# Altium schematic sheet Lab10.SCHDOC
size 420 x 297 mm; SheetNumber: 1; SheetTotal: 1; DocumentName: Sheet1.SCHDOC
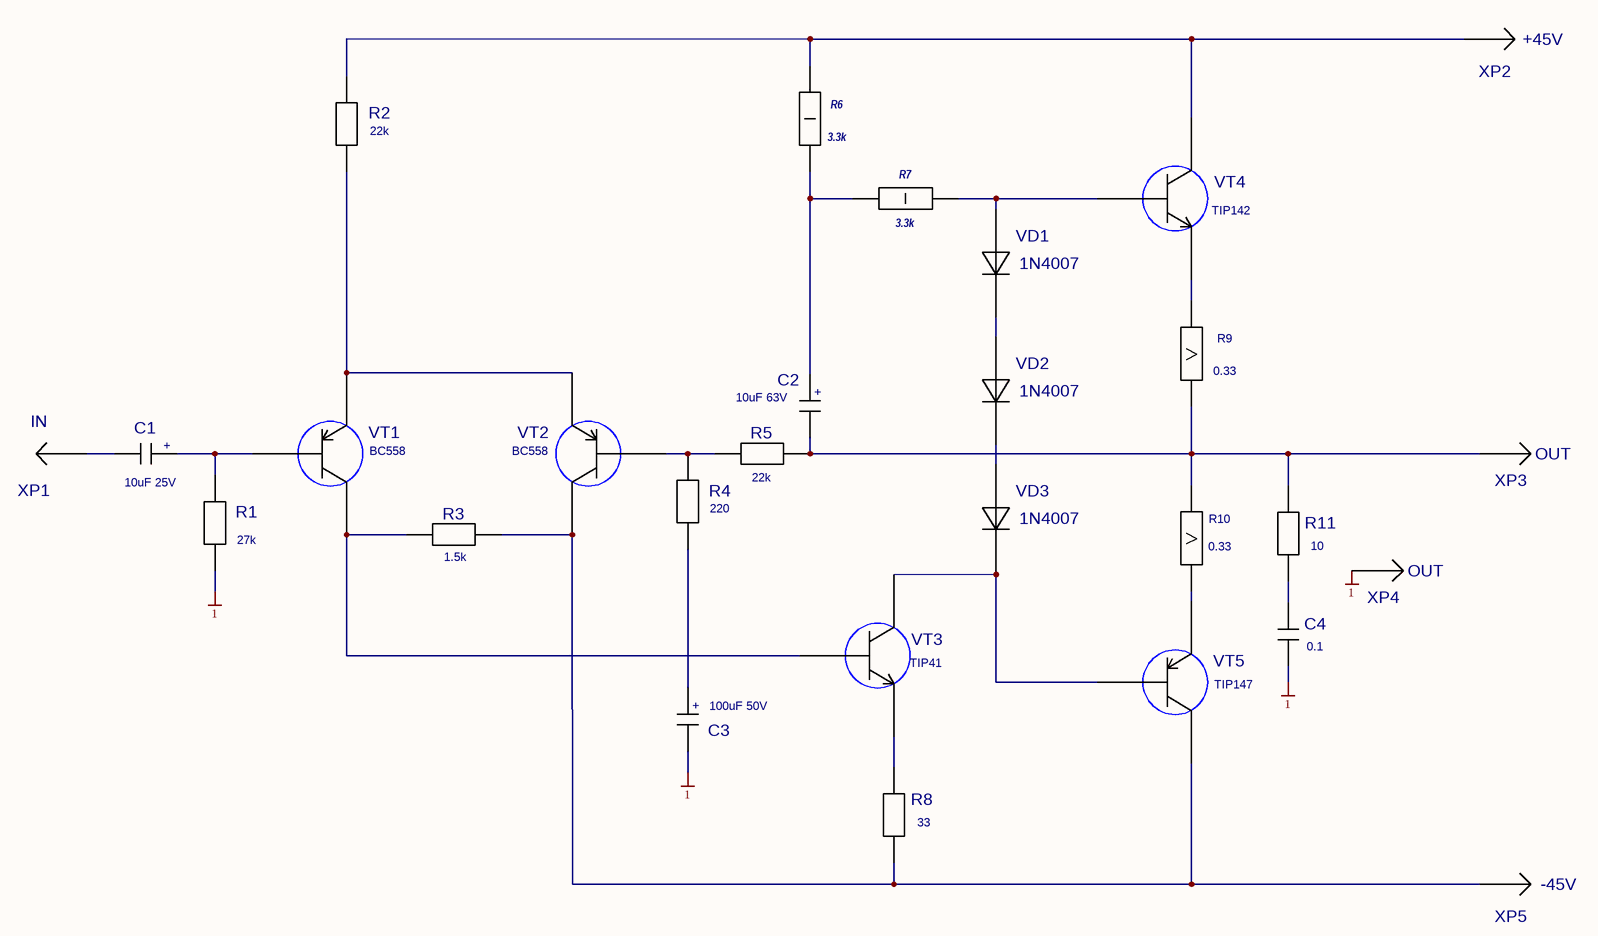
[diagram p0: Lab10.SCHDOC]

## Parts
C1  value 10uF 25V  [CAP2]  (hidden comment: CAP2)
C2  value 10uF 63V  [CAP2]  (hidden comment: CAP2)
C3  value 100uF 50V  [CAP2]  (hidden comment: CAP2)
C4  value 0.1  [CAP1]  (hidden comment: CAP1)
R1  value 27k  [RES]  (hidden comment: RES)
R2  value 22k  [RES]  (hidden comment: RES)
R3  value 1.5k  [RES]  (hidden comment: RES)
R4  value 220  [RES]  (hidden comment: RES)
R5  value 22k  [RES]  (hidden comment: RES)
R6  value 3.3k  [МЛТ(1)]  (hidden comment: МЛТ(1))
R7  value 3.3k  [МЛТ(1)]  (hidden comment: МЛТ(1))
R8  value 33  [RES]  (hidden comment: RES)
R9  value 0.33  [SQP5]  (hidden comment: SQP5)
R10  value 0.33  [SQP5]  (hidden comment: SQP5)
R11  value 10  [RES]  (hidden comment: RES)
VD1  1N4007  [1N4007]
VD2  1N4007  [1N4007]
VD3  1N4007  [1N4007]
VT1  BC558  [BC558]
VT2  BC558  [BC558]
VT3  TIP41  [TIP41]
VT4  TIP142  [TIP142]
VT5  TIP147  [TIP147]
XP1  value IN  [PAD]  (hidden comment: PAD)
XP2  value +45V  [PAD]  (hidden comment: PAD)
XP3  value OUT  [PAD]  (hidden comment: PAD)
XP4  value OUT  [PAD]  (hidden comment: PAD)
XP5  value -45V  [PAD]  (hidden comment: PAD)

## Nets
1: C3.2 C4.1 R1.1 XP4.1(A1)
NetC1_1: C1.1 R1.2 VT1.1
NetC1_2: C1.2 XP1.1(A1)
NetC2_1: C2.1 R6.1 R7.2
NetC2_2: C2.2 R5.1 R9.1 R10.2 R11.2 XP3.1(A1)
NetC3_1: C3.1 R4.1
NetC4_2: C4.2 R11.1
NetR2_1: R2.1 VT1.3 VT2.3
NetR2_2: R2.2 R6.2 VT4.2 XP2.1(A1)
NetR3_1: R3.1 R8.1 VT2.2 VT5.2 XP5.1(A1)
NetR3_2: R3.2 VT1.2 VT3.1
NetR4_2: R4.2 R5.2 VT2.1
NetR7_1: R7.1 VD1.2(A) VT4.1
NetR8_2: R8.2 VT3.3
NetR9_2: R9.2 VT4.3
NetR10_1: R10.1 VT5.3
NetVD1_1: VD1.1(K) VD2.2(A)
NetVD2_1: VD2.1(K) VD3.2(A)
NetVD3_1: VD3.1(K) VT3.2 VT5.1

## Notes on the sheet
- (in symbol CAP2) +

## Library data of the parts
VT1 VT2 = BC558: Value: *
VT3 = TIP41: Value: *
VT4 = TIP142: Value: *
VT5 = TIP147: Value: *